# EAGLE schematic matrix2 (EAGLE 5.10)
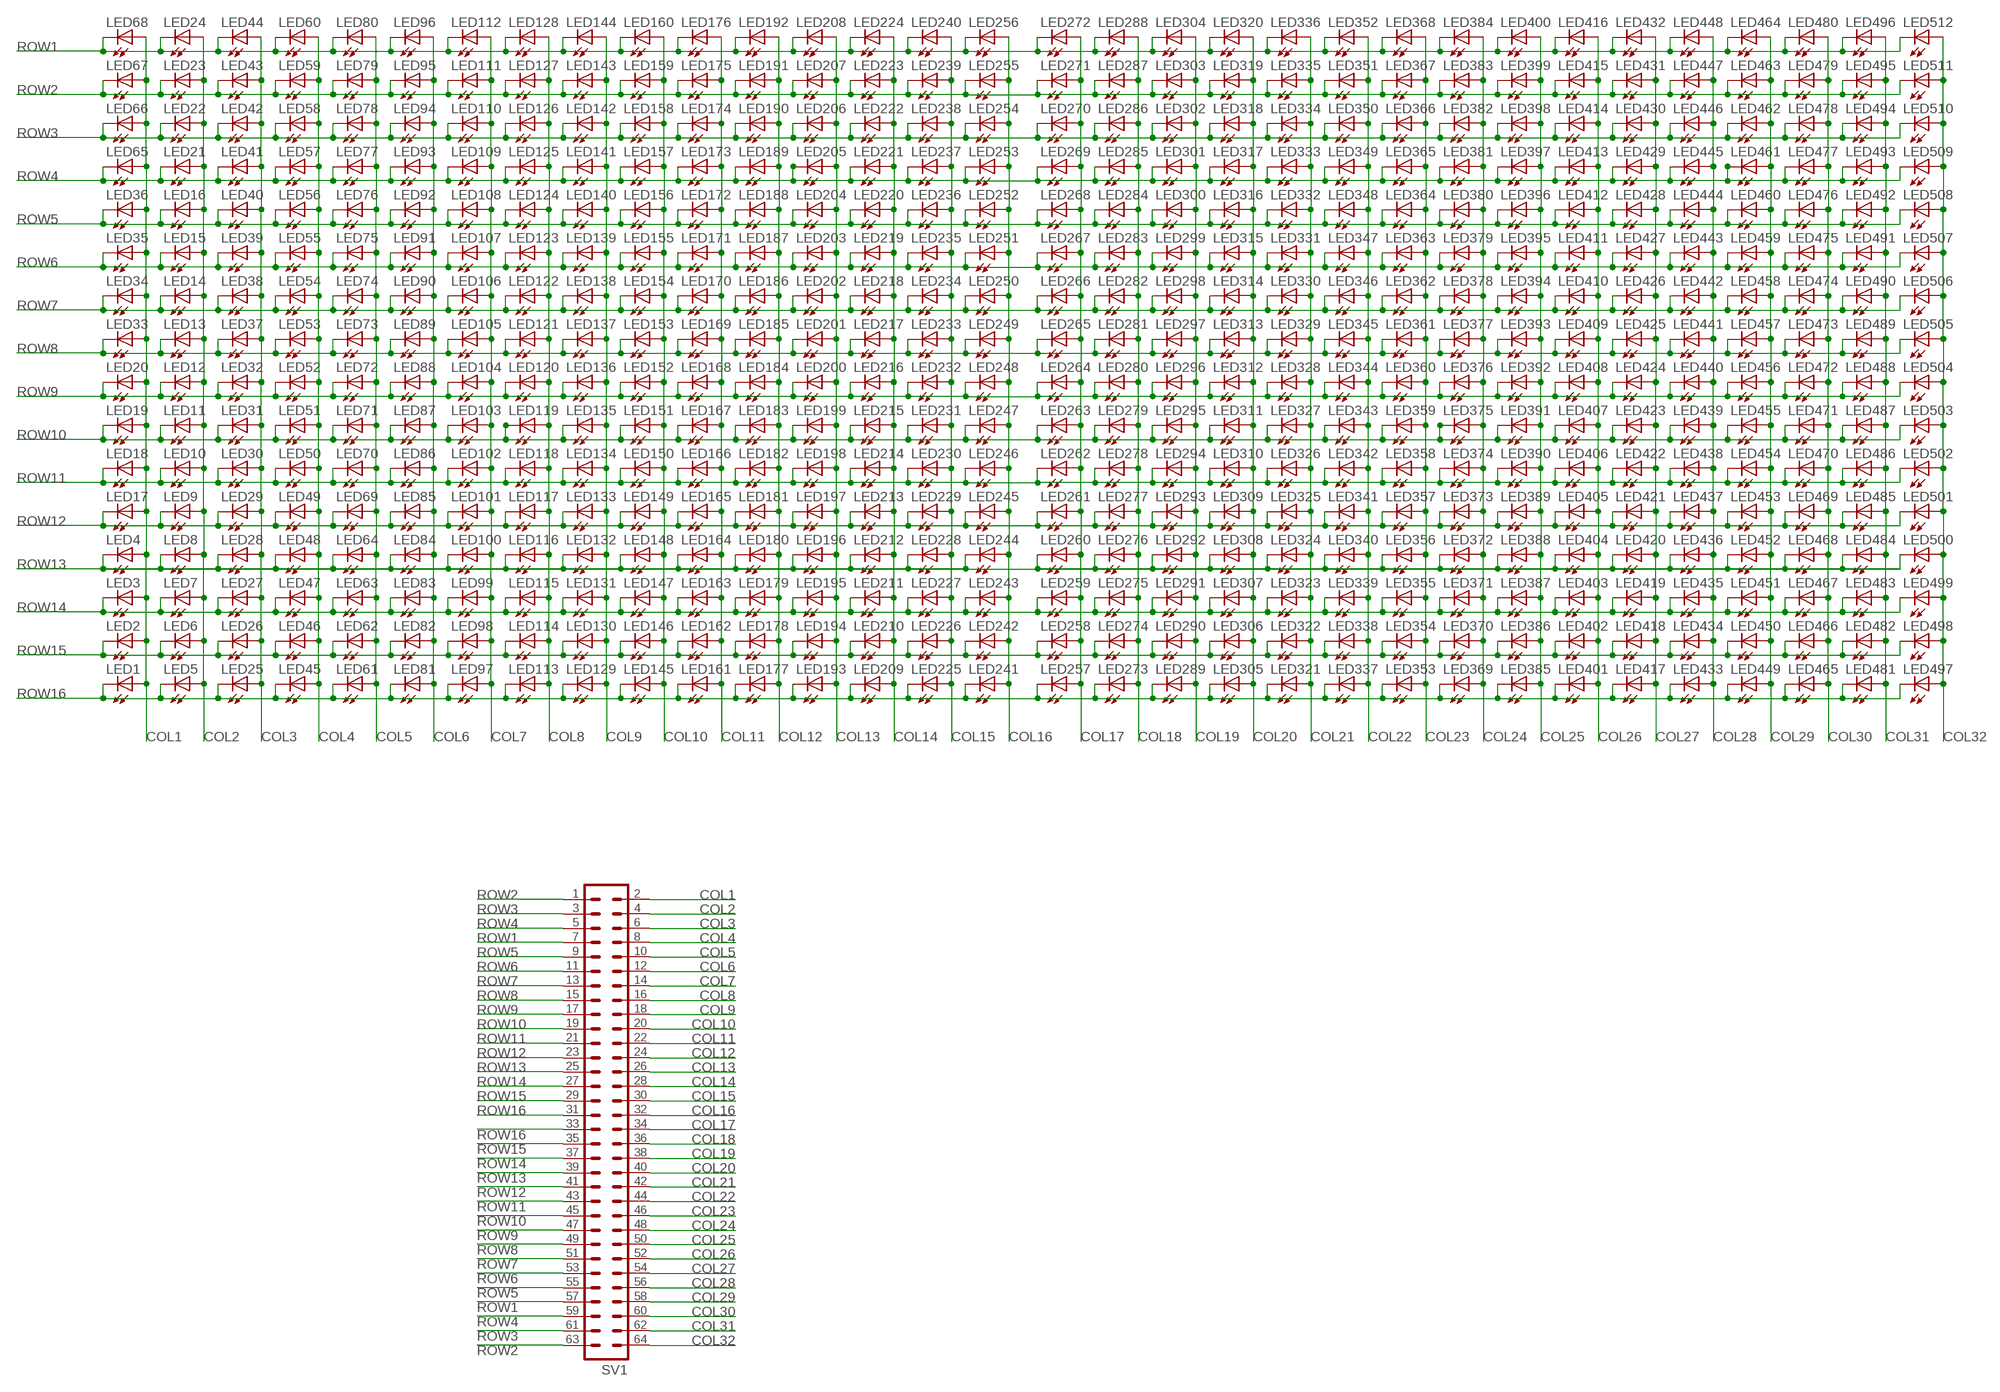
[diagram p0: schematic, sheet 1]

## Parts
LED1  LEDCHIP-LED0805  [CHIP-LED0805]
LED2  LEDCHIP-LED0805  [CHIP-LED0805]
LED3  LEDCHIP-LED0805  [CHIP-LED0805]
LED4  LEDCHIP-LED0805  [CHIP-LED0805]
LED5  LEDCHIP-LED0805  [CHIP-LED0805]
LED6  LEDCHIP-LED0805  [CHIP-LED0805]
LED7  LEDCHIP-LED0805  [CHIP-LED0805]
LED8  LEDCHIP-LED0805  [CHIP-LED0805]
LED9  LEDCHIP-LED0805  [CHIP-LED0805]
LED10  LEDCHIP-LED0805  [CHIP-LED0805]
LED11  LEDCHIP-LED0805  [CHIP-LED0805]
LED12  LEDCHIP-LED0805  [CHIP-LED0805]
LED13  LEDCHIP-LED0805  [CHIP-LED0805]
LED14  LEDCHIP-LED0805  [CHIP-LED0805]
LED15  LEDCHIP-LED0805  [CHIP-LED0805]
LED16  LEDCHIP-LED0805  [CHIP-LED0805]
LED17  LEDCHIP-LED0805  [CHIP-LED0805]
LED18  LEDCHIP-LED0805  [CHIP-LED0805]
LED19  LEDCHIP-LED0805  [CHIP-LED0805]
LED20  LEDCHIP-LED0805  [CHIP-LED0805]
LED21  LEDCHIP-LED0805  [CHIP-LED0805]
LED22  LEDCHIP-LED0805  [CHIP-LED0805]
LED23  LEDCHIP-LED0805  [CHIP-LED0805]
LED24  LEDCHIP-LED0805  [CHIP-LED0805]
LED25  LEDCHIP-LED0805  [CHIP-LED0805]
LED26  LEDCHIP-LED0805  [CHIP-LED0805]
LED27  LEDCHIP-LED0805  [CHIP-LED0805]
LED28  LEDCHIP-LED0805  [CHIP-LED0805]
LED29  LEDCHIP-LED0805  [CHIP-LED0805]
LED30  LEDCHIP-LED0805  [CHIP-LED0805]
LED31  LEDCHIP-LED0805  [CHIP-LED0805]
LED32  LEDCHIP-LED0805  [CHIP-LED0805]
LED33  LEDCHIP-LED0805  [CHIP-LED0805]
LED34  LEDCHIP-LED0805  [CHIP-LED0805]
LED35  LEDCHIP-LED0805  [CHIP-LED0805]
LED36  LEDCHIP-LED0805  [CHIP-LED0805]
LED37  LEDCHIP-LED0805  [CHIP-LED0805]
LED38  LEDCHIP-LED0805  [CHIP-LED0805]
LED39  LEDCHIP-LED0805  [CHIP-LED0805]
LED40  LEDCHIP-LED0805  [CHIP-LED0805]
LED41  LEDCHIP-LED0805  [CHIP-LED0805]
LED42  LEDCHIP-LED0805  [CHIP-LED0805]
LED43  LEDCHIP-LED0805  [CHIP-LED0805]
LED44  LEDCHIP-LED0805  [CHIP-LED0805]
LED45  LEDCHIP-LED0805  [CHIP-LED0805]
LED46  LEDCHIP-LED0805  [CHIP-LED0805]
LED47  LEDCHIP-LED0805  [CHIP-LED0805]
LED48  LEDCHIP-LED0805  [CHIP-LED0805]
LED49  LEDCHIP-LED0805  [CHIP-LED0805]
LED50  LEDCHIP-LED0805  [CHIP-LED0805]
LED51  LEDCHIP-LED0805  [CHIP-LED0805]
LED52  LEDCHIP-LED0805  [CHIP-LED0805]
LED53  LEDCHIP-LED0805  [CHIP-LED0805]
LED54  LEDCHIP-LED0805  [CHIP-LED0805]
LED55  LEDCHIP-LED0805  [CHIP-LED0805]
LED56  LEDCHIP-LED0805  [CHIP-LED0805]
LED57  LEDCHIP-LED0805  [CHIP-LED0805]
LED58  LEDCHIP-LED0805  [CHIP-LED0805]
LED59  LEDCHIP-LED0805  [CHIP-LED0805]
LED60  LEDCHIP-LED0805  [CHIP-LED0805]
LED61  LEDCHIP-LED0805  [CHIP-LED0805]
LED62  LEDCHIP-LED0805  [CHIP-LED0805]
LED63  LEDCHIP-LED0805  [CHIP-LED0805]
LED64  LEDCHIP-LED0805  [CHIP-LED0805]
LED65  LEDCHIP-LED0805  [CHIP-LED0805]
LED66  LEDCHIP-LED0805  [CHIP-LED0805]
LED67  LEDCHIP-LED0805  [CHIP-LED0805]
LED68  LEDCHIP-LED0805  [CHIP-LED0805]
LED69  LEDCHIP-LED0805  [CHIP-LED0805]
LED70  LEDCHIP-LED0805  [CHIP-LED0805]
LED71  LEDCHIP-LED0805  [CHIP-LED0805]
LED72  LEDCHIP-LED0805  [CHIP-LED0805]
LED73  LEDCHIP-LED0805  [CHIP-LED0805]
LED74  LEDCHIP-LED0805  [CHIP-LED0805]
LED75  LEDCHIP-LED0805  [CHIP-LED0805]
LED76  LEDCHIP-LED0805  [CHIP-LED0805]
LED77  LEDCHIP-LED0805  [CHIP-LED0805]
LED78  LEDCHIP-LED0805  [CHIP-LED0805]
LED79  LEDCHIP-LED0805  [CHIP-LED0805]
LED80  LEDCHIP-LED0805  [CHIP-LED0805]
LED81  LEDCHIP-LED0805  [CHIP-LED0805]
LED82  LEDCHIP-LED0805  [CHIP-LED0805]
LED83  LEDCHIP-LED0805  [CHIP-LED0805]
LED84  LEDCHIP-LED0805  [CHIP-LED0805]
LED85  LEDCHIP-LED0805  [CHIP-LED0805]
LED86  LEDCHIP-LED0805  [CHIP-LED0805]
LED87  LEDCHIP-LED0805  [CHIP-LED0805]
LED88  LEDCHIP-LED0805  [CHIP-LED0805]
LED89  LEDCHIP-LED0805  [CHIP-LED0805]
LED90  LEDCHIP-LED0805  [CHIP-LED0805]
LED91  LEDCHIP-LED0805  [CHIP-LED0805]
LED92  LEDCHIP-LED0805  [CHIP-LED0805]
LED93  LEDCHIP-LED0805  [CHIP-LED0805]
LED94  LEDCHIP-LED0805  [CHIP-LED0805]
LED95  LEDCHIP-LED0805  [CHIP-LED0805]
LED96  LEDCHIP-LED0805  [CHIP-LED0805]
LED97  LEDCHIP-LED0805  [CHIP-LED0805]
LED98  LEDCHIP-LED0805  [CHIP-LED0805]
LED99  LEDCHIP-LED0805  [CHIP-LED0805]
LED100  LEDCHIP-LED0805  [CHIP-LED0805]
LED101  LEDCHIP-LED0805  [CHIP-LED0805]
LED102  LEDCHIP-LED0805  [CHIP-LED0805]
LED103  LEDCHIP-LED0805  [CHIP-LED0805]
LED104  LEDCHIP-LED0805  [CHIP-LED0805]
LED105  LEDCHIP-LED0805  [CHIP-LED0805]
LED106  LEDCHIP-LED0805  [CHIP-LED0805]
LED107  LEDCHIP-LED0805  [CHIP-LED0805]
LED108  LEDCHIP-LED0805  [CHIP-LED0805]
LED109  LEDCHIP-LED0805  [CHIP-LED0805]
LED110  LEDCHIP-LED0805  [CHIP-LED0805]
LED111  LEDCHIP-LED0805  [CHIP-LED0805]
LED112  LEDCHIP-LED0805  [CHIP-LED0805]
LED113  LEDCHIP-LED0805  [CHIP-LED0805]
LED114  LEDCHIP-LED0805  [CHIP-LED0805]
LED115  LEDCHIP-LED0805  [CHIP-LED0805]
LED116  LEDCHIP-LED0805  [CHIP-LED0805]
LED117  LEDCHIP-LED0805  [CHIP-LED0805]
LED118  LEDCHIP-LED0805  [CHIP-LED0805]
LED119  LEDCHIP-LED0805  [CHIP-LED0805]
LED120  LEDCHIP-LED0805  [CHIP-LED0805]
LED121  LEDCHIP-LED0805  [CHIP-LED0805]
LED122  LEDCHIP-LED0805  [CHIP-LED0805]
LED123  LEDCHIP-LED0805  [CHIP-LED0805]
LED124  LEDCHIP-LED0805  [CHIP-LED0805]
LED125  LEDCHIP-LED0805  [CHIP-LED0805]
LED126  LEDCHIP-LED0805  [CHIP-LED0805]
LED127  LEDCHIP-LED0805  [CHIP-LED0805]
LED128  LEDCHIP-LED0805  [CHIP-LED0805]
LED129  LEDCHIP-LED0805  [CHIP-LED0805]
LED130  LEDCHIP-LED0805  [CHIP-LED0805]
LED131  LEDCHIP-LED0805  [CHIP-LED0805]
LED132  LEDCHIP-LED0805  [CHIP-LED0805]
LED133  LEDCHIP-LED0805  [CHIP-LED0805]
LED134  LEDCHIP-LED0805  [CHIP-LED0805]
LED135  LEDCHIP-LED0805  [CHIP-LED0805]
LED136  LEDCHIP-LED0805  [CHIP-LED0805]
LED137  LEDCHIP-LED0805  [CHIP-LED0805]
LED138  LEDCHIP-LED0805  [CHIP-LED0805]
LED139  LEDCHIP-LED0805  [CHIP-LED0805]
LED140  LEDCHIP-LED0805  [CHIP-LED0805]
LED141  LEDCHIP-LED0805  [CHIP-LED0805]
LED142  LEDCHIP-LED0805  [CHIP-LED0805]
LED143  LEDCHIP-LED0805  [CHIP-LED0805]
LED144  LEDCHIP-LED0805  [CHIP-LED0805]
LED145  LEDCHIP-LED0805  [CHIP-LED0805]
LED146  LEDCHIP-LED0805  [CHIP-LED0805]
LED147  LEDCHIP-LED0805  [CHIP-LED0805]
LED148  LEDCHIP-LED0805  [CHIP-LED0805]
LED149  LEDCHIP-LED0805  [CHIP-LED0805]
LED150  LEDCHIP-LED0805  [CHIP-LED0805]
LED151  LEDCHIP-LED0805  [CHIP-LED0805]
LED152  LEDCHIP-LED0805  [CHIP-LED0805]
LED153  LEDCHIP-LED0805  [CHIP-LED0805]
LED154  LEDCHIP-LED0805  [CHIP-LED0805]
LED155  LEDCHIP-LED0805  [CHIP-LED0805]
LED156  LEDCHIP-LED0805  [CHIP-LED0805]
LED157  LEDCHIP-LED0805  [CHIP-LED0805]
LED158  LEDCHIP-LED0805  [CHIP-LED0805]
LED159  LEDCHIP-LED0805  [CHIP-LED0805]
LED160  LEDCHIP-LED0805  [CHIP-LED0805]
LED161  LEDCHIP-LED0805  [CHIP-LED0805]
LED162  LEDCHIP-LED0805  [CHIP-LED0805]
LED163  LEDCHIP-LED0805  [CHIP-LED0805]
LED164  LEDCHIP-LED0805  [CHIP-LED0805]
LED165  LEDCHIP-LED0805  [CHIP-LED0805]
LED166  LEDCHIP-LED0805  [CHIP-LED0805]
LED167  LEDCHIP-LED0805  [CHIP-LED0805]
LED168  LEDCHIP-LED0805  [CHIP-LED0805]
LED169  LEDCHIP-LED0805  [CHIP-LED0805]
LED170  LEDCHIP-LED0805  [CHIP-LED0805]
LED171  LEDCHIP-LED0805  [CHIP-LED0805]
LED172  LEDCHIP-LED0805  [CHIP-LED0805]
LED173  LEDCHIP-LED0805  [CHIP-LED0805]
LED174  LEDCHIP-LED0805  [CHIP-LED0805]
LED175  LEDCHIP-LED0805  [CHIP-LED0805]
LED176  LEDCHIP-LED0805  [CHIP-LED0805]
LED177  LEDCHIP-LED0805  [CHIP-LED0805]
LED178  LEDCHIP-LED0805  [CHIP-LED0805]
LED179  LEDCHIP-LED0805  [CHIP-LED0805]
LED180  LEDCHIP-LED0805  [CHIP-LED0805]
LED181  LEDCHIP-LED0805  [CHIP-LED0805]
LED182  LEDCHIP-LED0805  [CHIP-LED0805]
LED183  LEDCHIP-LED0805  [CHIP-LED0805]
LED184  LEDCHIP-LED0805  [CHIP-LED0805]
LED185  LEDCHIP-LED0805  [CHIP-LED0805]
LED186  LEDCHIP-LED0805  [CHIP-LED0805]
LED187  LEDCHIP-LED0805  [CHIP-LED0805]
LED188  LEDCHIP-LED0805  [CHIP-LED0805]
LED189  LEDCHIP-LED0805  [CHIP-LED0805]
LED190  LEDCHIP-LED0805  [CHIP-LED0805]
LED191  LEDCHIP-LED0805  [CHIP-LED0805]
LED192  LEDCHIP-LED0805  [CHIP-LED0805]
LED193  LEDCHIP-LED0805  [CHIP-LED0805]
LED194  LEDCHIP-LED0805  [CHIP-LED0805]
LED195  LEDCHIP-LED0805  [CHIP-LED0805]
LED196  LEDCHIP-LED0805  [CHIP-LED0805]
LED197  LEDCHIP-LED0805  [CHIP-LED0805]
LED198  LEDCHIP-LED0805  [CHIP-LED0805]
LED199  LEDCHIP-LED0805  [CHIP-LED0805]
LED200  LEDCHIP-LED0805  [CHIP-LED0805]
LED201  LEDCHIP-LED0805  [CHIP-LED0805]
LED202  LEDCHIP-LED0805  [CHIP-LED0805]
LED203  LEDCHIP-LED0805  [CHIP-LED0805]
LED204  LEDCHIP-LED0805  [CHIP-LED0805]
LED205  LEDCHIP-LED0805  [CHIP-LED0805]
LED206  LEDCHIP-LED0805  [CHIP-LED0805]
LED207  LEDCHIP-LED0805  [CHIP-LED0805]
LED208  LEDCHIP-LED0805  [CHIP-LED0805]
LED209  LEDCHIP-LED0805  [CHIP-LED0805]
LED210  LEDCHIP-LED0805  [CHIP-LED0805]
LED211  LEDCHIP-LED0805  [CHIP-LED0805]
LED212  LEDCHIP-LED0805  [CHIP-LED0805]
LED213  LEDCHIP-LED0805  [CHIP-LED0805]
LED214  LEDCHIP-LED0805  [CHIP-LED0805]
LED215  LEDCHIP-LED0805  [CHIP-LED0805]
LED216  LEDCHIP-LED0805  [CHIP-LED0805]
LED217  LEDCHIP-LED0805  [CHIP-LED0805]
LED218  LEDCHIP-LED0805  [CHIP-LED0805]
LED219  LEDCHIP-LED0805  [CHIP-LED0805]
LED220  LEDCHIP-LED0805  [CHIP-LED0805]
LED221  LEDCHIP-LED0805  [CHIP-LED0805]
LED222  LEDCHIP-LED0805  [CHIP-LED0805]
LED223  LEDCHIP-LED0805  [CHIP-LED0805]
LED224  LEDCHIP-LED0805  [CHIP-LED0805]
LED225  LEDCHIP-LED0805  [CHIP-LED0805]
LED226  LEDCHIP-LED0805  [CHIP-LED0805]
LED227  LEDCHIP-LED0805  [CHIP-LED0805]
LED228  LEDCHIP-LED0805  [CHIP-LED0805]
LED229  LEDCHIP-LED0805  [CHIP-LED0805]
LED230  LEDCHIP-LED0805  [CHIP-LED0805]
LED231  LEDCHIP-LED0805  [CHIP-LED0805]
LED232  LEDCHIP-LED0805  [CHIP-LED0805]
LED233  LEDCHIP-LED0805  [CHIP-LED0805]
LED234  LEDCHIP-LED0805  [CHIP-LED0805]
LED235  LEDCHIP-LED0805  [CHIP-LED0805]
LED236  LEDCHIP-LED0805  [CHIP-LED0805]
LED237  LEDCHIP-LED0805  [CHIP-LED0805]
LED238  LEDCHIP-LED0805  [CHIP-LED0805]
LED239  LEDCHIP-LED0805  [CHIP-LED0805]
LED240  LEDCHIP-LED0805  [CHIP-LED0805]
LED241  LEDCHIP-LED0805  [CHIP-LED0805]
LED242  LEDCHIP-LED0805  [CHIP-LED0805]
LED243  LEDCHIP-LED0805  [CHIP-LED0805]
LED244  LEDCHIP-LED0805  [CHIP-LED0805]
LED245  LEDCHIP-LED0805  [CHIP-LED0805]
LED246  LEDCHIP-LED0805  [CHIP-LED0805]
LED247  LEDCHIP-LED0805  [CHIP-LED0805]
LED248  LEDCHIP-LED0805  [CHIP-LED0805]
LED249  LEDCHIP-LED0805  [CHIP-LED0805]
LED250  LEDCHIP-LED0805  [CHIP-LED0805]
LED251  LEDCHIP-LED0805  [CHIP-LED0805]
LED252  LEDCHIP-LED0805  [CHIP-LED0805]
LED253  LEDCHIP-LED0805  [CHIP-LED0805]
LED254  LEDCHIP-LED0805  [CHIP-LED0805]
LED255  LEDCHIP-LED0805  [CHIP-LED0805]
LED256  LEDCHIP-LED0805  [CHIP-LED0805]
LED257  LEDCHIP-LED0805  [CHIP-LED0805]
LED258  LEDCHIP-LED0805  [CHIP-LED0805]
LED259  LEDCHIP-LED0805  [CHIP-LED0805]
LED260  LEDCHIP-LED0805  [CHIP-LED0805]
LED261  LEDCHIP-LED0805  [CHIP-LED0805]
LED262  LEDCHIP-LED0805  [CHIP-LED0805]
LED263  LEDCHIP-LED0805  [CHIP-LED0805]
LED264  LEDCHIP-LED0805  [CHIP-LED0805]
LED265  LEDCHIP-LED0805  [CHIP-LED0805]
LED266  LEDCHIP-LED0805  [CHIP-LED0805]
LED267  LEDCHIP-LED0805  [CHIP-LED0805]
LED268  LEDCHIP-LED0805  [CHIP-LED0805]
LED269  LEDCHIP-LED0805  [CHIP-LED0805]
LED270  LEDCHIP-LED0805  [CHIP-LED0805]
LED271  LEDCHIP-LED0805  [CHIP-LED0805]
LED272  LEDCHIP-LED0805  [CHIP-LED0805]
LED273  LEDCHIP-LED0805  [CHIP-LED0805]
LED274  LEDCHIP-LED0805  [CHIP-LED0805]
LED275  LEDCHIP-LED0805  [CHIP-LED0805]
LED276  LEDCHIP-LED0805  [CHIP-LED0805]
LED277  LEDCHIP-LED0805  [CHIP-LED0805]
LED278  LEDCHIP-LED0805  [CHIP-LED0805]
LED279  LEDCHIP-LED0805  [CHIP-LED0805]
LED280  LEDCHIP-LED0805  [CHIP-LED0805]
LED281  LEDCHIP-LED0805  [CHIP-LED0805]
LED282  LEDCHIP-LED0805  [CHIP-LED0805]
LED283  LEDCHIP-LED0805  [CHIP-LED0805]
LED284  LEDCHIP-LED0805  [CHIP-LED0805]
LED285  LEDCHIP-LED0805  [CHIP-LED0805]
LED286  LEDCHIP-LED0805  [CHIP-LED0805]
LED287  LEDCHIP-LED0805  [CHIP-LED0805]
LED288  LEDCHIP-LED0805  [CHIP-LED0805]
LED289  LEDCHIP-LED0805  [CHIP-LED0805]
LED290  LEDCHIP-LED0805  [CHIP-LED0805]
LED291  LEDCHIP-LED0805  [CHIP-LED0805]
LED292  LEDCHIP-LED0805  [CHIP-LED0805]
LED293  LEDCHIP-LED0805  [CHIP-LED0805]
LED294  LEDCHIP-LED0805  [CHIP-LED0805]
LED295  LEDCHIP-LED0805  [CHIP-LED0805]
LED296  LEDCHIP-LED0805  [CHIP-LED0805]
LED297  LEDCHIP-LED0805  [CHIP-LED0805]
LED298  LEDCHIP-LED0805  [CHIP-LED0805]
LED299  LEDCHIP-LED0805  [CHIP-LED0805]
LED300  LEDCHIP-LED0805  [CHIP-LED0805]
LED301  LEDCHIP-LED0805  [CHIP-LED0805]
LED302  LEDCHIP-LED0805  [CHIP-LED0805]
LED303  LEDCHIP-LED0805  [CHIP-LED0805]
LED304  LEDCHIP-LED0805  [CHIP-LED0805]
LED305  LEDCHIP-LED0805  [CHIP-LED0805]
LED306  LEDCHIP-LED0805  [CHIP-LED0805]
LED307  LEDCHIP-LED0805  [CHIP-LED0805]
LED308  LEDCHIP-LED0805  [CHIP-LED0805]
LED309  LEDCHIP-LED0805  [CHIP-LED0805]
LED310  LEDCHIP-LED0805  [CHIP-LED0805]
LED311  LEDCHIP-LED0805  [CHIP-LED0805]
LED312  LEDCHIP-LED0805  [CHIP-LED0805]
LED313  LEDCHIP-LED0805  [CHIP-LED0805]
LED314  LEDCHIP-LED0805  [CHIP-LED0805]
LED315  LEDCHIP-LED0805  [CHIP-LED0805]
LED316  LEDCHIP-LED0805  [CHIP-LED0805]
LED317  LEDCHIP-LED0805  [CHIP-LED0805]
LED318  LEDCHIP-LED0805  [CHIP-LED0805]
LED319  LEDCHIP-LED0805  [CHIP-LED0805]
LED320  LEDCHIP-LED0805  [CHIP-LED0805]
LED321  LEDCHIP-LED0805  [CHIP-LED0805]
LED322  LEDCHIP-LED0805  [CHIP-LED0805]
LED323  LEDCHIP-LED0805  [CHIP-LED0805]
LED324  LEDCHIP-LED0805  [CHIP-LED0805]
LED325  LEDCHIP-LED0805  [CHIP-LED0805]
LED326  LEDCHIP-LED0805  [CHIP-LED0805]
LED327  LEDCHIP-LED0805  [CHIP-LED0805]
LED328  LEDCHIP-LED0805  [CHIP-LED0805]
LED329  LEDCHIP-LED0805  [CHIP-LED0805]
LED330  LEDCHIP-LED0805  [CHIP-LED0805]
LED331  LEDCHIP-LED0805  [CHIP-LED0805]
LED332  LEDCHIP-LED0805  [CHIP-LED0805]
LED333  LEDCHIP-LED0805  [CHIP-LED0805]
LED334  LEDCHIP-LED0805  [CHIP-LED0805]
LED335  LEDCHIP-LED0805  [CHIP-LED0805]
LED336  LEDCHIP-LED0805  [CHIP-LED0805]
LED337  LEDCHIP-LED0805  [CHIP-LED0805]
LED338  LEDCHIP-LED0805  [CHIP-LED0805]
LED339  LEDCHIP-LED0805  [CHIP-LED0805]
LED340  LEDCHIP-LED0805  [CHIP-LED0805]
LED341  LEDCHIP-LED0805  [CHIP-LED0805]
LED342  LEDCHIP-LED0805  [CHIP-LED0805]
LED343  LEDCHIP-LED0805  [CHIP-LED0805]
LED344  LEDCHIP-LED0805  [CHIP-LED0805]
LED345  LEDCHIP-LED0805  [CHIP-LED0805]
LED346  LEDCHIP-LED0805  [CHIP-LED0805]
LED347  LEDCHIP-LED0805  [CHIP-LED0805]
LED348  LEDCHIP-LED0805  [CHIP-LED0805]
LED349  LEDCHIP-LED0805  [CHIP-LED0805]
LED350  LEDCHIP-LED0805  [CHIP-LED0805]
LED351  LEDCHIP-LED0805  [CHIP-LED0805]
LED352  LEDCHIP-LED0805  [CHIP-LED0805]
LED353  LEDCHIP-LED0805  [CHIP-LED0805]
LED354  LEDCHIP-LED0805  [CHIP-LED0805]
LED355  LEDCHIP-LED0805  [CHIP-LED0805]
LED356  LEDCHIP-LED0805  [CHIP-LED0805]
LED357  LEDCHIP-LED0805  [CHIP-LED0805]
LED358  LEDCHIP-LED0805  [CHIP-LED0805]
LED359  LEDCHIP-LED0805  [CHIP-LED0805]
LED360  LEDCHIP-LED0805  [CHIP-LED0805]
LED361  LEDCHIP-LED0805  [CHIP-LED0805]
LED362  LEDCHIP-LED0805  [CHIP-LED0805]
LED363  LEDCHIP-LED0805  [CHIP-LED0805]
LED364  LEDCHIP-LED0805  [CHIP-LED0805]
LED365  LEDCHIP-LED0805  [CHIP-LED0805]
LED366  LEDCHIP-LED0805  [CHIP-LED0805]
LED367  LEDCHIP-LED0805  [CHIP-LED0805]
LED368  LEDCHIP-LED0805  [CHIP-LED0805]
LED369  LEDCHIP-LED0805  [CHIP-LED0805]
LED370  LEDCHIP-LED0805  [CHIP-LED0805]
LED371  LEDCHIP-LED0805  [CHIP-LED0805]
LED372  LEDCHIP-LED0805  [CHIP-LED0805]
LED373  LEDCHIP-LED0805  [CHIP-LED0805]
LED374  LEDCHIP-LED0805  [CHIP-LED0805]
LED375  LEDCHIP-LED0805  [CHIP-LED0805]
LED376  LEDCHIP-LED0805  [CHIP-LED0805]
LED377  LEDCHIP-LED0805  [CHIP-LED0805]
LED378  LEDCHIP-LED0805  [CHIP-LED0805]
LED379  LEDCHIP-LED0805  [CHIP-LED0805]
LED380  LEDCHIP-LED0805  [CHIP-LED0805]
LED381  LEDCHIP-LED0805  [CHIP-LED0805]
LED382  LEDCHIP-LED0805  [CHIP-LED0805]
LED383  LEDCHIP-LED0805  [CHIP-LED0805]
LED384  LEDCHIP-LED0805  [CHIP-LED0805]
LED385  LEDCHIP-LED0805  [CHIP-LED0805]
LED386  LEDCHIP-LED0805  [CHIP-LED0805]
LED387  LEDCHIP-LED0805  [CHIP-LED0805]
LED388  LEDCHIP-LED0805  [CHIP-LED0805]
LED389  LEDCHIP-LED0805  [CHIP-LED0805]
LED390  LEDCHIP-LED0805  [CHIP-LED0805]
LED391  LEDCHIP-LED0805  [CHIP-LED0805]
LED392  LEDCHIP-LED0805  [CHIP-LED0805]
LED393  LEDCHIP-LED0805  [CHIP-LED0805]
LED394  LEDCHIP-LED0805  [CHIP-LED0805]
LED395  LEDCHIP-LED0805  [CHIP-LED0805]
LED396  LEDCHIP-LED0805  [CHIP-LED0805]
LED397  LEDCHIP-LED0805  [CHIP-LED0805]
LED398  LEDCHIP-LED0805  [CHIP-LED0805]
LED399  LEDCHIP-LED0805  [CHIP-LED0805]
LED400  LEDCHIP-LED0805  [CHIP-LED0805]
LED401  LEDCHIP-LED0805  [CHIP-LED0805]
LED402  LEDCHIP-LED0805  [CHIP-LED0805]
LED403  LEDCHIP-LED0805  [CHIP-LED0805]
LED404  LEDCHIP-LED0805  [CHIP-LED0805]
LED405  LEDCHIP-LED0805  [CHIP-LED0805]
LED406  LEDCHIP-LED0805  [CHIP-LED0805]
LED407  LEDCHIP-LED0805  [CHIP-LED0805]
LED408  LEDCHIP-LED0805  [CHIP-LED0805]
LED409  LEDCHIP-LED0805  [CHIP-LED0805]
LED410  LEDCHIP-LED0805  [CHIP-LED0805]
LED411  LEDCHIP-LED0805  [CHIP-LED0805]
LED412  LEDCHIP-LED0805  [CHIP-LED0805]
LED413  LEDCHIP-LED0805  [CHIP-LED0805]
LED414  LEDCHIP-LED0805  [CHIP-LED0805]
LED415  LEDCHIP-LED0805  [CHIP-LED0805]
LED416  LEDCHIP-LED0805  [CHIP-LED0805]
LED417  LEDCHIP-LED0805  [CHIP-LED0805]
LED418  LEDCHIP-LED0805  [CHIP-LED0805]
LED419  LEDCHIP-LED0805  [CHIP-LED0805]
LED420  LEDCHIP-LED0805  [CHIP-LED0805]
LED421  LEDCHIP-LED0805  [CHIP-LED0805]
LED422  LEDCHIP-LED0805  [CHIP-LED0805]
LED423  LEDCHIP-LED0805  [CHIP-LED0805]
LED424  LEDCHIP-LED0805  [CHIP-LED0805]
LED425  LEDCHIP-LED0805  [CHIP-LED0805]
LED426  LEDCHIP-LED0805  [CHIP-LED0805]
LED427  LEDCHIP-LED0805  [CHIP-LED0805]
LED428  LEDCHIP-LED0805  [CHIP-LED0805]
LED429  LEDCHIP-LED0805  [CHIP-LED0805]
LED430  LEDCHIP-LED0805  [CHIP-LED0805]
LED431  LEDCHIP-LED0805  [CHIP-LED0805]
LED432  LEDCHIP-LED0805  [CHIP-LED0805]
LED433  LEDCHIP-LED0805  [CHIP-LED0805]
LED434  LEDCHIP-LED0805  [CHIP-LED0805]
LED435  LEDCHIP-LED0805  [CHIP-LED0805]
LED436  LEDCHIP-LED0805  [CHIP-LED0805]
LED437  LEDCHIP-LED0805  [CHIP-LED0805]
LED438  LEDCHIP-LED0805  [CHIP-LED0805]
LED439  LEDCHIP-LED0805  [CHIP-LED0805]
LED440  LEDCHIP-LED0805  [CHIP-LED0805]
LED441  LEDCHIP-LED0805  [CHIP-LED0805]
LED442  LEDCHIP-LED0805  [CHIP-LED0805]
LED443  LEDCHIP-LED0805  [CHIP-LED0805]
LED444  LEDCHIP-LED0805  [CHIP-LED0805]
LED445  LEDCHIP-LED0805  [CHIP-LED0805]
LED446  LEDCHIP-LED0805  [CHIP-LED0805]
LED447  LEDCHIP-LED0805  [CHIP-LED0805]
LED448  LEDCHIP-LED0805  [CHIP-LED0805]
LED449  LEDCHIP-LED0805  [CHIP-LED0805]
LED450  LEDCHIP-LED0805  [CHIP-LED0805]
LED451  LEDCHIP-LED0805  [CHIP-LED0805]
LED452  LEDCHIP-LED0805  [CHIP-LED0805]
LED453  LEDCHIP-LED0805  [CHIP-LED0805]
LED454  LEDCHIP-LED0805  [CHIP-LED0805]
LED455  LEDCHIP-LED0805  [CHIP-LED0805]
LED456  LEDCHIP-LED0805  [CHIP-LED0805]
LED457  LEDCHIP-LED0805  [CHIP-LED0805]
LED458  LEDCHIP-LED0805  [CHIP-LED0805]
LED459  LEDCHIP-LED0805  [CHIP-LED0805]
LED460  LEDCHIP-LED0805  [CHIP-LED0805]
LED461  LEDCHIP-LED0805  [CHIP-LED0805]
LED462  LEDCHIP-LED0805  [CHIP-LED0805]
LED463  LEDCHIP-LED0805  [CHIP-LED0805]
LED464  LEDCHIP-LED0805  [CHIP-LED0805]
LED465  LEDCHIP-LED0805  [CHIP-LED0805]
LED466  LEDCHIP-LED0805  [CHIP-LED0805]
LED467  LEDCHIP-LED0805  [CHIP-LED0805]
LED468  LEDCHIP-LED0805  [CHIP-LED0805]
LED469  LEDCHIP-LED0805  [CHIP-LED0805]
LED470  LEDCHIP-LED0805  [CHIP-LED0805]
LED471  LEDCHIP-LED0805  [CHIP-LED0805]
LED472  LEDCHIP-LED0805  [CHIP-LED0805]
LED473  LEDCHIP-LED0805  [CHIP-LED0805]
LED474  LEDCHIP-LED0805  [CHIP-LED0805]
LED475  LEDCHIP-LED0805  [CHIP-LED0805]
LED476  LEDCHIP-LED0805  [CHIP-LED0805]
LED477  LEDCHIP-LED0805  [CHIP-LED0805]
LED478  LEDCHIP-LED0805  [CHIP-LED0805]
LED479  LEDCHIP-LED0805  [CHIP-LED0805]
LED480  LEDCHIP-LED0805  [CHIP-LED0805]
LED481  LEDCHIP-LED0805  [CHIP-LED0805]
LED482  LEDCHIP-LED0805  [CHIP-LED0805]
LED483  LEDCHIP-LED0805  [CHIP-LED0805]
LED484  LEDCHIP-LED0805  [CHIP-LED0805]
LED485  LEDCHIP-LED0805  [CHIP-LED0805]
LED486  LEDCHIP-LED0805  [CHIP-LED0805]
LED487  LEDCHIP-LED0805  [CHIP-LED0805]
LED488  LEDCHIP-LED0805  [CHIP-LED0805]
LED489  LEDCHIP-LED0805  [CHIP-LED0805]
LED490  LEDCHIP-LED0805  [CHIP-LED0805]
LED491  LEDCHIP-LED0805  [CHIP-LED0805]
LED492  LEDCHIP-LED0805  [CHIP-LED0805]
LED493  LEDCHIP-LED0805  [CHIP-LED0805]
LED494  LEDCHIP-LED0805  [CHIP-LED0805]
LED495  LEDCHIP-LED0805  [CHIP-LED0805]
LED496  LEDCHIP-LED0805  [CHIP-LED0805]
LED497  LEDCHIP-LED0805  [CHIP-LED0805]
LED498  LEDCHIP-LED0805  [CHIP-LED0805]
LED499  LEDCHIP-LED0805  [CHIP-LED0805]
LED500  LEDCHIP-LED0805  [CHIP-LED0805]
LED501  LEDCHIP-LED0805  [CHIP-LED0805]
LED502  LEDCHIP-LED0805  [CHIP-LED0805]
LED503  LEDCHIP-LED0805  [CHIP-LED0805]
LED504  LEDCHIP-LED0805  [CHIP-LED0805]
LED505  LEDCHIP-LED0805  [CHIP-LED0805]
LED506  LEDCHIP-LED0805  [CHIP-LED0805]
LED507  LEDCHIP-LED0805  [CHIP-LED0805]
LED508  LEDCHIP-LED0805  [CHIP-LED0805]
LED509  LEDCHIP-LED0805  [CHIP-LED0805]
LED510  LEDCHIP-LED0805  [CHIP-LED0805]
LED511  LEDCHIP-LED0805  [CHIP-LED0805]
LED512  LEDCHIP-LED0805  [CHIP-LED0805]
SV1  ML64*  [ML64_K]

## Nets
COL1: LED1.A LED2.A LED3.A LED4.A LED17.A LED18.A LED19.A LED20.A LED33.A LED34.A LED35.A LED36.A LED65.A LED66.A LED67.A LED68.A SV1.2
COL2: LED5.A LED6.A LED7.A LED8.A LED9.A LED10.A LED11.A LED12.A LED13.A LED14.A LED15.A LED16.A LED21.A LED22.A LED23.A LED24.A SV1.4
COL3: LED25.A LED26.A LED27.A LED28.A LED29.A LED30.A LED31.A LED32.A LED37.A LED38.A LED39.A LED40.A LED41.A LED42.A LED43.A LED44.A SV1.6
COL4: LED45.A LED46.A LED47.A LED48.A LED49.A LED50.A LED51.A LED52.A LED53.A LED54.A LED55.A LED56.A LED57.A LED58.A LED59.A LED60.A SV1.8
COL5: LED61.A LED62.A LED63.A LED64.A LED69.A LED70.A LED71.A LED72.A LED73.A LED74.A LED75.A LED76.A LED77.A LED78.A LED79.A LED80.A SV1.10
COL6: LED81.A LED82.A LED83.A LED84.A LED85.A LED86.A LED87.A LED88.A LED89.A LED90.A LED91.A LED92.A LED93.A LED94.A LED95.A LED96.A SV1.12
COL7: LED97.A LED98.A LED99.A LED100.A LED101.A LED102.A LED103.A LED104.A LED105.A LED106.A LED107.A LED108.A LED109.A LED110.A LED111.A LED112.A SV1.14
COL8: LED113.A LED114.A LED115.A LED116.A LED117.A LED118.A LED119.A LED120.A LED121.A LED122.A LED123.A LED124.A LED125.A LED126.A LED127.A LED128.A SV1.16
COL9: LED129.A LED130.A LED131.A LED132.A LED133.A LED134.A LED135.A LED136.A LED137.A LED138.A LED139.A LED140.A LED141.A LED142.A LED143.A LED144.A SV1.18
COL10: LED145.A LED146.A LED147.A LED148.A LED149.A LED150.A LED151.A LED152.A LED153.A LED154.A LED155.A LED156.A LED157.A LED158.A LED159.A LED160.A SV1.20
COL11: LED161.A LED162.A LED163.A LED164.A LED165.A LED166.A LED167.A LED168.A LED169.A LED170.A LED171.A LED172.A LED173.A LED174.A LED175.A LED176.A SV1.22
COL12: LED177.A LED178.A LED179.A LED180.A LED181.A LED182.A LED183.A LED184.A LED185.A LED186.A LED187.A LED188.A LED189.A LED190.A LED191.A LED192.A SV1.24
COL13: LED193.A LED194.A LED195.A LED196.A LED197.A LED198.A LED199.A LED200.A LED201.A LED202.A LED203.A LED204.A LED205.A LED206.A LED207.A LED208.A SV1.26
COL14: LED209.A LED210.A LED211.A LED212.A LED213.A LED214.A LED215.A LED216.A LED217.A LED218.A LED219.A LED220.A LED221.A LED222.A LED223.A LED224.A SV1.28
COL15: LED225.A LED226.A LED227.A LED228.A LED229.A LED230.A LED231.A LED232.A LED233.A LED234.A LED235.A LED236.A LED237.A LED238.A LED239.A LED240.A SV1.30
COL16: LED241.A LED242.A LED243.A LED244.A LED245.A LED246.A LED247.A LED248.A LED249.A LED250.A LED251.A LED252.A LED253.A LED254.A LED255.A LED256.A SV1.32
COL17: LED257.A LED258.A LED259.A LED260.A LED261.A LED262.A LED263.A LED264.A LED265.A LED266.A LED267.A LED268.A LED269.A LED270.A LED271.A LED272.A SV1.34
COL18: LED273.A LED274.A LED275.A LED276.A LED277.A LED278.A LED279.A LED280.A LED281.A LED282.A LED283.A LED284.A LED285.A LED286.A LED287.A LED288.A SV1.36
COL19: LED289.A LED290.A LED291.A LED292.A LED293.A LED294.A LED295.A LED296.A LED297.A LED298.A LED299.A LED300.A LED301.A LED302.A LED303.A LED304.A SV1.38
COL20: LED305.A LED306.A LED307.A LED308.A LED309.A LED310.A LED311.A LED312.A LED313.A LED314.A LED315.A LED316.A LED317.A LED318.A LED319.A LED320.A SV1.40
COL21: LED321.A LED322.A LED323.A LED324.A LED325.A LED326.A LED327.A LED328.A LED329.A LED330.A LED331.A LED332.A LED333.A LED334.A LED335.A LED336.A SV1.42
COL22: LED337.A LED338.A LED339.A LED340.A LED341.A LED342.A LED343.A LED344.A LED345.A LED346.A LED347.A LED348.A LED349.A LED350.A LED351.A LED352.A SV1.44
COL23: LED353.A LED354.A LED355.A LED356.A LED357.A LED358.A LED359.A LED360.A LED361.A LED362.A LED363.A LED364.A LED365.A LED366.A LED367.A LED368.A SV1.46
COL24: LED369.A LED370.A LED371.A LED372.A LED373.A LED374.A LED375.A LED376.A LED377.A LED378.A LED379.A LED380.A LED381.A LED382.A LED383.A LED384.A SV1.48
COL25: LED385.A LED386.A LED387.A LED388.A LED389.A LED390.A LED391.A LED392.A LED393.A LED394.A LED395.A LED396.A LED397.A LED398.A LED399.A LED400.A SV1.50
COL26: LED401.A LED402.A LED403.A LED404.A LED405.A LED406.A LED407.A LED408.A LED409.A LED410.A LED411.A LED412.A LED413.A LED414.A LED415.A LED416.A SV1.52
COL27: LED417.A LED418.A LED419.A LED420.A LED421.A LED422.A LED423.A LED424.A LED425.A LED426.A LED427.A LED428.A LED429.A LED430.A LED431.A LED432.A SV1.54
COL28: LED433.A LED434.A LED435.A LED436.A LED437.A LED438.A LED439.A LED440.A LED441.A LED442.A LED443.A LED444.A LED445.A LED446.A LED447.A LED448.A SV1.56
COL29: LED449.A LED450.A LED451.A LED452.A LED453.A LED454.A LED455.A LED456.A LED457.A LED458.A LED459.A LED460.A LED461.A LED462.A LED463.A LED464.A SV1.58
COL30: LED465.A LED466.A LED467.A LED468.A LED469.A LED470.A LED471.A LED472.A LED473.A LED474.A LED475.A LED476.A LED477.A LED478.A LED479.A LED480.A SV1.60
COL31: LED481.A LED482.A LED483.A LED484.A LED485.A LED486.A LED487.A LED488.A LED489.A LED490.A LED491.A LED492.A LED493.A LED494.A LED495.A LED496.A SV1.62
COL32: LED497.A LED498.A LED499.A LED500.A LED501.A LED502.A LED503.A LED504.A LED505.A LED506.A LED507.A LED508.A LED509.A LED510.A LED511.A LED512.A SV1.64
ROW1: LED24.C LED44.C LED60.C LED68.C LED80.C LED96.C LED112.C LED128.C LED144.C LED160.C LED176.C LED192.C LED208.C LED224.C LED240.C LED256.C LED272.C LED288.C LED304.C LED320.C LED336.C LED352.C LED368.C LED384.C LED400.C LED416.C LED432.C LED448.C LED464.C LED480.C LED496.C LED512.C SV1.7 SV1.57
ROW2: LED23.C LED43.C LED59.C LED67.C LED79.C LED95.C LED111.C LED127.C LED143.C LED159.C LED175.C LED191.C LED207.C LED223.C LED239.C LED255.C LED271.C LED287.C LED303.C LED319.C LED335.C LED351.C LED367.C LED383.C LED399.C LED415.C LED431.C LED447.C LED463.C LED479.C LED495.C LED511.C SV1.1 SV1.63
ROW3: LED22.C LED42.C LED58.C LED66.C LED78.C LED94.C LED110.C LED126.C LED142.C LED158.C LED174.C LED190.C LED206.C LED222.C LED238.C LED254.C LED270.C LED286.C LED302.C LED318.C LED334.C LED350.C LED366.C LED382.C LED398.C LED414.C LED430.C LED446.C LED462.C LED478.C LED494.C LED510.C SV1.3 SV1.61
ROW4: LED21.C LED41.C LED57.C LED65.C LED77.C LED93.C LED109.C LED125.C LED141.C LED157.C LED173.C LED189.C LED205.C LED221.C LED237.C LED253.C LED269.C LED285.C LED301.C LED317.C LED333.C LED349.C LED365.C LED381.C LED397.C LED413.C LED429.C LED445.C LED461.C LED477.C LED493.C LED509.C SV1.5 SV1.59
ROW5: LED16.C LED36.C LED40.C LED56.C LED76.C LED92.C LED108.C LED124.C LED140.C LED156.C LED172.C LED188.C LED204.C LED220.C LED236.C LED252.C LED268.C LED284.C LED300.C LED316.C LED332.C LED348.C LED364.C LED380.C LED396.C LED412.C LED428.C LED444.C LED460.C LED476.C LED492.C LED508.C SV1.9 SV1.55
ROW6: LED15.C LED35.C LED39.C LED55.C LED75.C LED91.C LED107.C LED123.C LED139.C LED155.C LED171.C LED187.C LED203.C LED219.C LED235.C LED251.C LED267.C LED283.C LED299.C LED315.C LED331.C LED347.C LED363.C LED379.C LED395.C LED411.C LED427.C LED443.C LED459.C LED475.C LED491.C LED507.C SV1.11 SV1.53
ROW7: LED14.C LED34.C LED38.C LED54.C LED74.C LED90.C LED106.C LED122.C LED138.C LED154.C LED170.C LED186.C LED202.C LED218.C LED234.C LED250.C LED266.C LED282.C LED298.C LED314.C LED330.C LED346.C LED362.C LED378.C LED394.C LED410.C LED426.C LED442.C LED458.C LED474.C LED490.C LED506.C SV1.13 SV1.51
ROW8: LED13.C LED33.C LED37.C LED53.C LED73.C LED89.C LED105.C LED121.C LED137.C LED153.C LED169.C LED185.C LED201.C LED217.C LED233.C LED249.C LED265.C LED281.C LED297.C LED313.C LED329.C LED345.C LED361.C LED377.C LED393.C LED409.C LED425.C LED441.C LED457.C LED473.C LED489.C LED505.C SV1.15 SV1.49
ROW9: LED12.C LED20.C LED32.C LED52.C LED72.C LED88.C LED104.C LED120.C LED136.C LED152.C LED168.C LED184.C LED200.C LED216.C LED232.C LED248.C LED264.C LED280.C LED296.C LED312.C LED328.C LED344.C LED360.C LED376.C LED392.C LED408.C LED424.C LED440.C LED456.C LED472.C LED488.C LED504.C SV1.17 SV1.47
ROW10: LED11.C LED19.C LED31.C LED51.C LED71.C LED87.C LED103.C LED119.C LED135.C LED151.C LED167.C LED183.C LED199.C LED215.C LED231.C LED247.C LED263.C LED279.C LED295.C LED311.C LED327.C LED343.C LED359.C LED375.C LED391.C LED407.C LED423.C LED439.C LED455.C LED471.C LED487.C LED503.C SV1.19 SV1.45
ROW11: LED10.C LED18.C LED30.C LED50.C LED70.C LED86.C LED102.C LED118.C LED134.C LED150.C LED166.C LED182.C LED198.C LED214.C LED230.C LED246.C LED262.C LED278.C LED294.C LED310.C LED326.C LED342.C LED358.C LED374.C LED390.C LED406.C LED422.C LED438.C LED454.C LED470.C LED486.C LED502.C SV1.21 SV1.43
ROW12: LED9.C LED17.C LED29.C LED49.C LED69.C LED85.C LED101.C LED117.C LED133.C LED149.C LED165.C LED181.C LED197.C LED213.C LED229.C LED245.C LED261.C LED277.C LED293.C LED309.C LED325.C LED341.C LED357.C LED373.C LED389.C LED405.C LED421.C LED437.C LED453.C LED469.C LED485.C LED501.C SV1.23 SV1.41
ROW13: LED4.C LED8.C LED28.C LED48.C LED64.C LED84.C LED100.C LED116.C LED132.C LED148.C LED164.C LED180.C LED196.C LED212.C LED228.C LED244.C LED260.C LED276.C LED292.C LED308.C LED324.C LED340.C LED356.C LED372.C LED388.C LED404.C LED420.C LED436.C LED452.C LED468.C LED484.C LED500.C SV1.25 SV1.39
ROW14: LED3.C LED7.C LED27.C LED47.C LED63.C LED83.C LED99.C LED115.C LED131.C LED147.C LED163.C LED179.C LED195.C LED211.C LED227.C LED243.C LED259.C LED275.C LED291.C LED307.C LED323.C LED339.C LED355.C LED371.C LED387.C LED403.C LED419.C LED435.C LED451.C LED467.C LED483.C LED499.C SV1.27 SV1.37
ROW15: LED2.C LED6.C LED26.C LED46.C LED62.C LED82.C LED98.C LED114.C LED130.C LED146.C LED162.C LED178.C LED194.C LED210.C LED226.C LED242.C LED258.C LED274.C LED290.C LED306.C LED322.C LED338.C LED354.C LED370.C LED386.C LED402.C LED418.C LED434.C LED450.C LED466.C LED482.C LED498.C SV1.29 SV1.35
ROW16: LED1.C LED5.C LED25.C LED45.C LED61.C LED81.C LED97.C LED113.C LED129.C LED145.C LED161.C LED177.C LED193.C LED209.C LED225.C LED241.C LED257.C LED273.C LED289.C LED305.C LED321.C LED337.C LED353.C LED369.C LED385.C LED401.C LED417.C LED433.C LED449.C LED465.C LED481.C LED497.C SV1.31 SV1.33

## Library data of the parts
LED1-LED512 = led:LED: LED OSRAM: - CHIPLED LG R971, LG N971, LY N971, LG Q971, LY Q971, LO R971, LY R971 LH N974, LH R974 LS Q976, LO Q976, LY Q976 LO Q996 - Hyper CHIPLED LW Q18S LB Q993, LB Q99A, LB R99A - SideLED LS A670, LO A670, LY A670, LG A670, LP A670 LB A673, LV A673, LT A673, LW A673 LH A674 LY A675 LS A676, LA A676, LO A676, LY A676, LW A676 LS A679, LY A679, LG A679 - Hyper Micro SIDELED® LS Y876, LA Y876, LO Y876, LY Y876 LT Y87S - SmartLED LW L88C, LW L88S LB L89C, LB L89S, LG L890 LS L89K, LO L89K, LY L89K LS L896, LA L896, LO L896, LY L896 - TOPLED LS T670, LO T670, LY T670, LG T670, LP T670 LSG T670, LSP T670, LSY T670, LOP T670, LYG T670 LG T671, LOG T671, LSG T671 LB T673, LV T673, LT T673, LW T673 LH T674 LS T676, LA T676, LO T676, LY T676, LB T676, LH T676, LSB T676, LW T676 LB T67C, LV T67C, LT T67C, LS T67K, LO T67K, LY T67K, LW E67C LS E67B, LA E67B, LO E67B, LY E67B, LB E67C, LV E67C, LT E67C LW T67C LS T679, LY T679, LG T679 LS T770, LO T770, LY T770, LG T770, LP T770 LB T773, LV T773, LT T773, LW T773 LH T774 LS E675, LA E675, LY E675, LS T675 LS T776, LA T776, LO T776, LY T776, LB T776 LHGB T686 LT T68C, LB T68C - Hyper Mini TOPLED® LB M676 - Mini TOPLED Santana® LG M470 LS M47K, LO M47K, LY M47K Source: http://www.osram.convergy.de LUXEON: - LUMILED® LXK2-PW12-R00, LXK2-PW12-S00, LXK2-PW14-U00, LXK2-PW14-V00 LXK2-PM12-R00, LXK2-PM12-S00, LXK2-PM14-U00 LXK2-PE12-Q00, LXK2-PE12-R00, LXK2-PE12-S00, LXK2-PE14-T00, LXK2-PE14-U00 LXK2-PB12-K00, LXK2-PB12-L00, LXK2-PB12-M00, LXK2-PB14-N00, LXK2-PB14-P00, LXK2-PB14-Q00 LXK2-PR12-L00, LXK2-PR12-M00, LXK2-PR14-Q00, LXK2-PR14-R00 LXK2-PD12-Q00, LXK2-PD12-R00, LXK2-PD12-S00 LXK2-PH12-R00, LXK2-PH12-S00 LXK2-PL12-P00, LXK2-PL12-Q00, LXK2-PL12-R00 Source: www.luxeon.com KINGBRIGHT: KA-3528ASYC Source: www.kingbright.com
SV1 = con-ml:ML64: HARTING